# EAGLE design untitled (EAGLE 9.6.2)
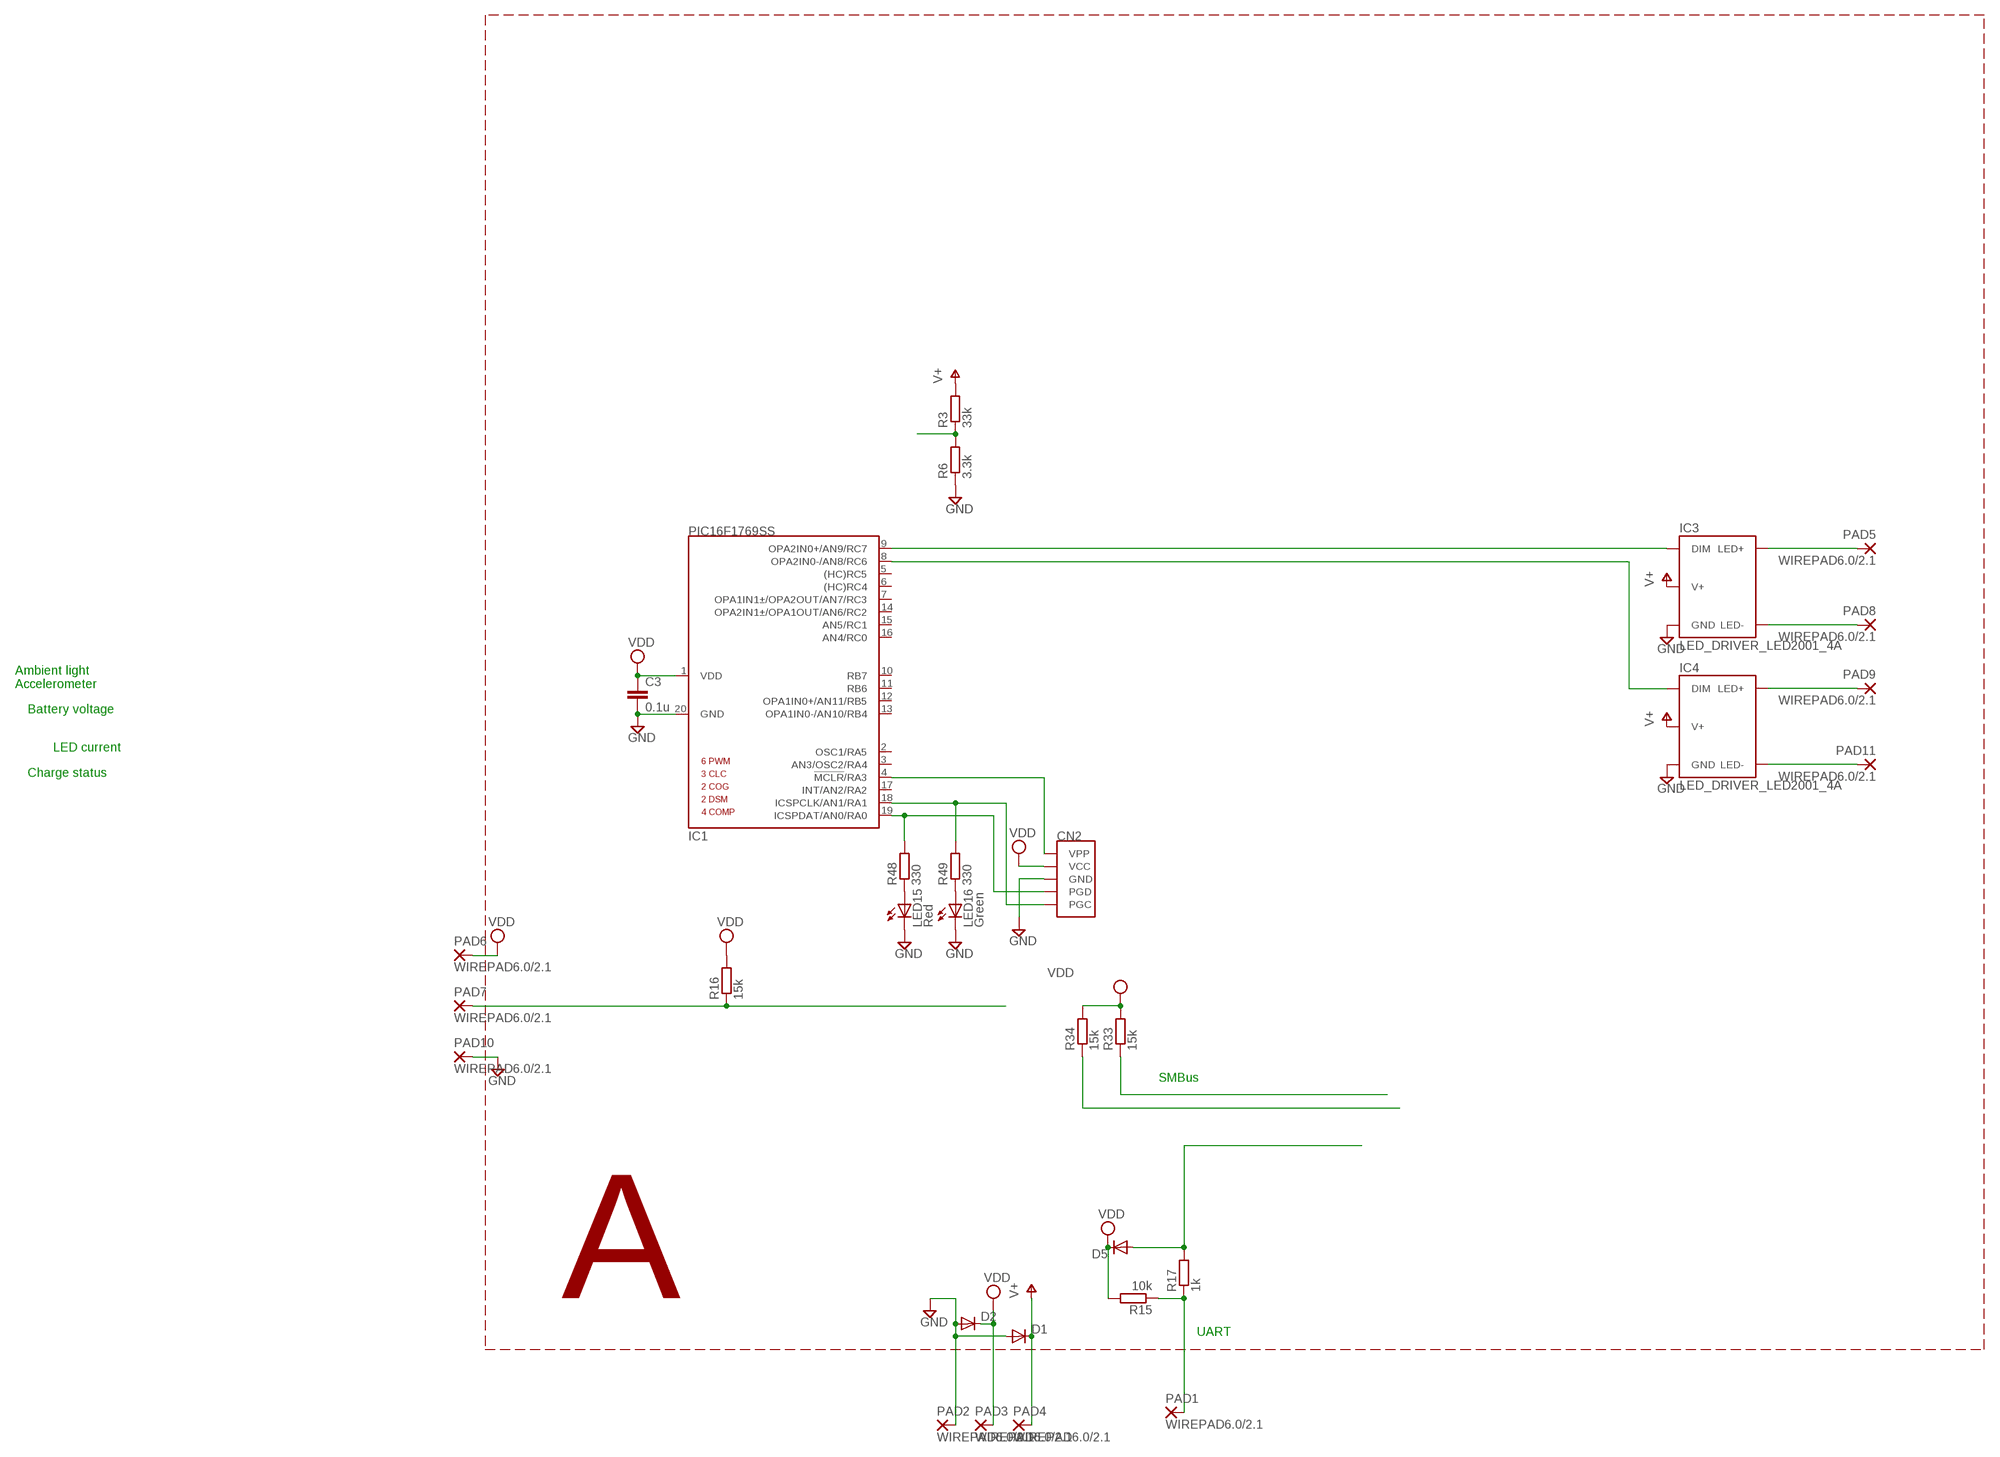
[diagram p0: schematic, sheet 1]

## Parts
C3  0.1u  C-EUC0402  [C0402]
CN2  ICSPPIN  [MINI-ICSP_PIN]
D1  DIODE-VMN2  [VMN2]
D2  DIODE-VMN2  [VMN2]
D5  DIODE-VMN2  [VMN2]
IC1  PIC16F1769SS  [SSOP20]
IC3  LED_DRIVER_LED2001_4A  [LED_DRIVER_LED2001_4A]
IC4  LED_DRIVER_LED2001_4A  [LED_DRIVER_LED2001_4A]
LED15  Red  LED3MM  [LED3MM]
LED16  Green  LED3MM  [LED3MM]
PAD1  WIREPAD6.0/2.1  [6.0/2.1]
PAD2  WIREPAD6.0/2.1  [6.0/2.1]
PAD3  WIREPAD6.0/2.1  [6.0/2.1]
PAD4  WIREPAD6.0/2.1  [6.0/2.1]
PAD5  WIREPAD6.0/2.1  [6.0/2.1]
PAD6  WIREPAD6.0/2.1  [6.0/2.1]
PAD7  WIREPAD6.0/2.1  [6.0/2.1]
PAD8  WIREPAD6.0/2.1  [6.0/2.1]
PAD9  WIREPAD6.0/2.1  [6.0/2.1]
PAD10  WIREPAD6.0/2.1  [6.0/2.1]
PAD11  WIREPAD6.0/2.1  [6.0/2.1]
R3  33k  R-EU_R0402  [R0402]
R6  3.3k  R-EU_R0402  [R0402]
R15  10k  R-EU_R0402  [R0402]
R16  15k  R-EU_R0402  [R0402]
R17  1k  R-EU_R0402  [R0402]
R33  15k  R-EU_R0402  [R0402]
R34  15k  R-EU_R0402  [R0402]
R48  330  R-EU_R0402  [R0402]
R49  330  R-EU_R0402  [R0402]

## Nets
GND: C3.2 CN2.GND D1.A D2.A IC1.20(GND) IC3.GND IC4.GND LED15.K(C) LED16.K(C) PAD2.1(P) PAD10.1(P) R6.1
N$1: IC3.LED+ PAD5.1(P)
N$2: IC3.LED- PAD8.1(P)
N$3: CN2.VPP IC1.4(!MCLR!/RA3)
N$4: R3.1 R6.2
N$5: IC4.LED+ PAD9.1(P)
N$6: IC4.LED- PAD11.1(P)
N$7: IC1.9(OPA2IN0+/AN9/RC7) IC3.DIM
N$8: IC1.8(OPA2IN0-/AN8/RC6) IC4.DIM
N$14: CN2.PGD IC1.19(ICSPDAT/AN0/RA0) R48.2
N$16: CN2.PGC IC1.18(ICSPCLK/AN1/RA1) R49.2
N$23: PAD7.1(P) R16.1
N$31: D5.A R17.2
N$57: PAD1.1(P) R15.1 R17.1
N$70: R34.1
N$71: R33.1
N$103: LED15.A R48.1
N$104: LED16.A R49.1
V+: D1.C IC3.V+ IC4.V+ PAD4.1(P) R3.2
VDD: C3.1 CN2.VCC D2.C D5.C IC1.1(VDD) PAD3.1(P) PAD6.1(P) R15.2 R16.2 R33.2 R34.2
Unconnected: IC1.2(OSC1/RA5) IC1.3(AN3/OSC2/RA4) IC1.5((HC)RC5) IC1.6((HC)RC4) IC1.7(OPA1IN1±/OPA2OUT/AN7/RC3) IC1.10(RB7) IC1.11(RB6) IC1.12(OPA1IN0+/AN11/RB5) IC1.13(OPA1IN0-/AN10/RB4) IC1.14(OPA2IN1±/OPA1OUT/AN6/RC2) IC1.15(AN5/RC1) IC1.16(AN4/RC0) IC1.17(INT/AN2/RA2)

## Notes on the sheet
- Ambient light
  Accelerometer
- Battery voltage
- LED current
- Charge status
- SMBus
- A
- UART

## Library data of the parts
C3 = rcl:C-EU: CAPACITOR, European symbol; SPICEPREFIX: C
CN2 = 0 my parts:ICSP
D1 D2 D5 = 5 D:DIODE-: DIODE
IC1 = 0 my parts:PIC16F1769
IC3 IC4 = 0 my parts:LED_DRIVER_LED2001_4A
LED15 LED16 = 0 my parts:LED: LED OSRAM: - CHIPLED LG R971, LG N971, LY N971, LG Q971, LY Q971, LO R971, LY R971 LH N974, LH R974 LS Q976, LO Q976, LY Q976 LO Q996 - Hyper CHIPLED LW Q18S LB Q993, LB Q99A, LB R99A - SideLED LS A670, LO A670, LY A670, LG A670, LP A670 LB A673, LV A673, LT A673, LW A673 LH A674 LY A675 LS A676, LA A676, LO A676, LY A676, LW A676 LS A679, LY A679, LG A679 - Hyper Micro SIDELED® LS Y876, LA Y876, LO Y876, LY Y876 LT Y87S - SmartLED LW L88C, LW L88S LB L89C, LB L89S, LG L890 LS L89K, LO L89K, LY L89K LS L896, LA L896, LO L896, LY L896 - TOPLED LS T670, LO T670, LY T670, LG T670, LP T670 LSG T670, LSP T670, LSY T670, LOP T670, LYG T670 LG T671, LOG T671, LSG T671 LB T673, LV T673, LT T673, LW T673 LH T674 LS T676, LA T676, LO T676, LY T676, LB T676, LH T676, LSB T676, LW T676 LB T67C, LV T67C, LT T67C, LS T67K, LO T67K, LY T67K, LW E67C LS E67B, LA E67B, LO E67B, LY E67B, LB E67C, LV E67C, LT E67C LW T67C LS T679, LY T679, LG T679 LS T770, LO T770, LY T770, LG T770, LP T770 LB T773, LV T773, LT T773, LW T773 LH T774 LS E675, LA E675, LY E675, LS T675 LS T776, LA T776, LO T776, LY T776, LB T776 LHGB T686 LT T68C, LB T68C - Hyper Mini TOPLED® LB M676 - Mini TOPLED Santana® LG M470 LS M47K, LO M47K, LY M47K Source: http://www.osram.convergy.de - LUMILED® LXK2-PW12-R00, LXK2-PW12-S00, LXK2-PW14-U00, LXK2-PW14-V00 LXK2-PM12-R00, LXK2-PM12-S00, LXK2-PM14-U00 LXK2-PE12-Q00, LXK2-PE12-R00, LXK2-PE12-S00, LXK2-PE14-T00, LXK2-PE14-U00 LXK2-PB12-K00, LXK2-PB12-L00, LXK2-PB12-M00, LXK2-PB14-N00, LXK2-PB14-P00, LXK2-PB14-Q00 LXK2-PR12-L00, LXK2-PR12-M00, LXK2-PR14-Q00, LXK2-PR14-R00 LXK2-PD12-Q00, LXK2-PD12-R00, LXK2-PD12-S00 LXK2-PH12-R00, LXK2-PH12-S00 LXK2-PL12-P00, LXK2-PL12-Q00, LXK2-PL12-R00 Source: www.luxeon.com
PAD1-PAD11 = 4 PAD:WIREPAD: Wire PAD connect wire on PCB
R3 R6 R15-R17 R33 R34 R48 R49 = rcl:R-EU_: RESISTOR, European symbol; SPICEPREFIX: R

## Board
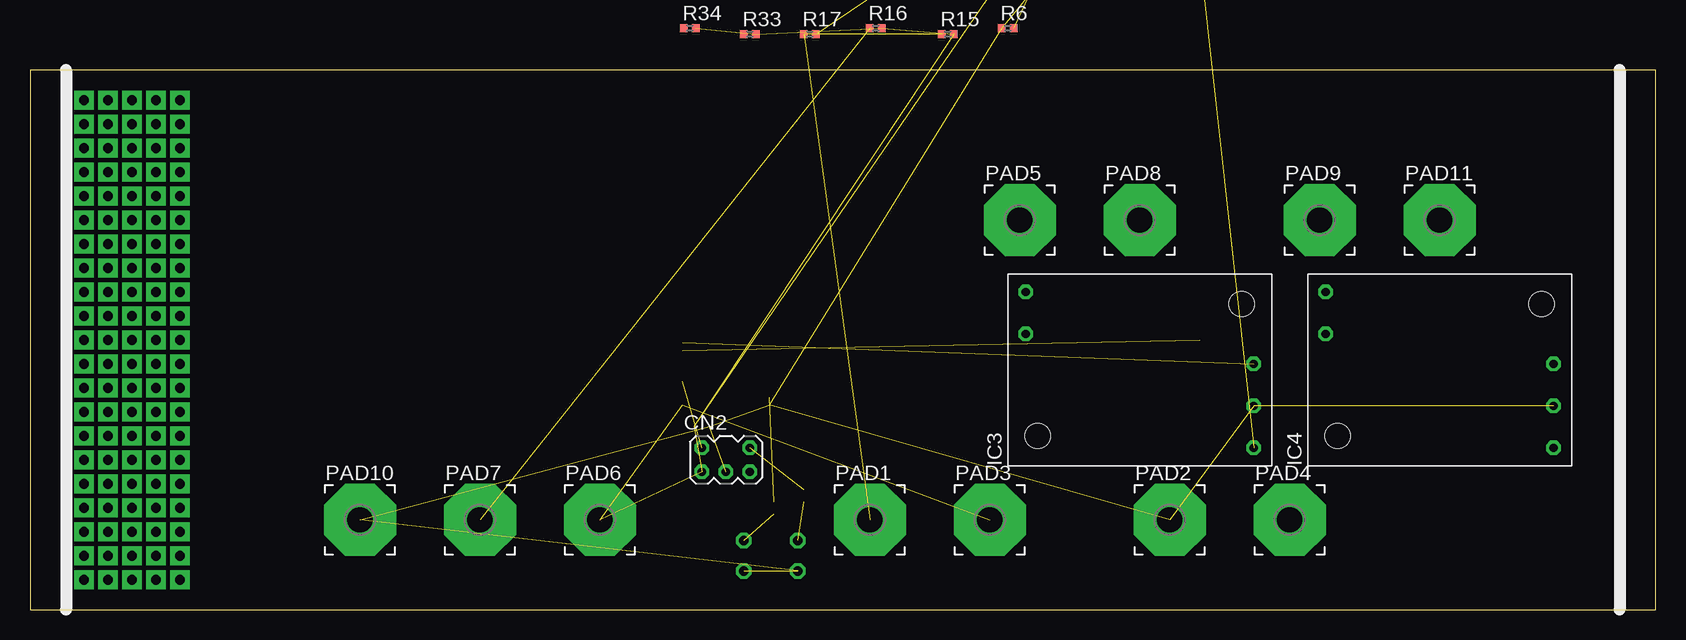
[diagram p1: board, top side]
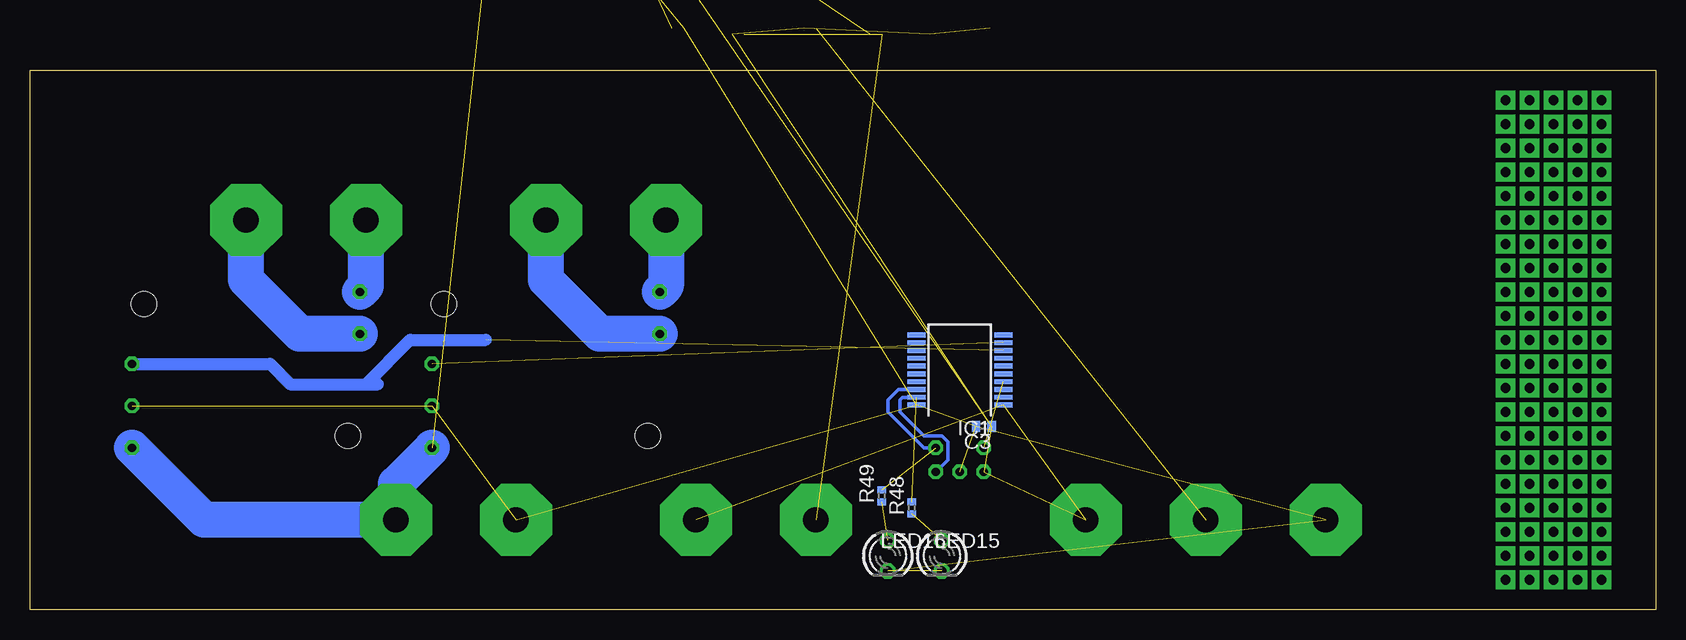
[diagram p2: board, bottom side, seen from below]

Size 135.5 x 45 mm. Coordinates in mm from the lower left corner, seen from the top.
Outline: 0,0 135.5,0 135.5,45 0,45 0,0
Copper layers (1*16): Top 0.035mm / dielectric 1.5mm / Bottom 0.035mm
Design rules "default": minimum track width 6mil, minimum drill 0.35mm, track to track 6mil, track to pad 6mil, pad to pad 6mil, via to via 6mil, smd to smd 6mil, copper to edge 40mil, drill to drill 6mil, minimum pad ring 10mil, minimum via ring 8mil, stop-mask expansion 4mil, vias tented up to drill 0mil, thermal gap 10mil

### Footprints (pad centres in the part's own frame; a part is rotated, then mirrored left to right if it is on the bottom)
C0402 = smd 0.7 x 0.9: 1 -0.65,0; 2 0.65,0
MINI-ICSP_PIN = drill 0.7 octagon: GND 0,-1; PGC 2,1; PGD 2,-1; VCC -2,-1; VPP -2,1
VMN2 = smd 0.65 x 0.55: A 0.6,0; C -0.6,0
SSOP20 = smd 0.4 x 1.5: 1 -2.925,-3.625; 2 -2.275,-3.625; 3 -1.625,-3.625; 4 -0.975,-3.625; 5 -0.325,-3.625; 6 0.325,-3.625; 7 0.975,-3.625; 8 1.625,-3.625; 9 2.275,-3.625; 10 2.925,-3.625; 11 2.925,3.625; 12 2.275,3.625; 13 1.625,3.625; 14 0.975,3.625; 15 0.325,3.625; 16 -0.325,3.625; 17 -0.975,3.625; 18 -1.625,3.625; 19 -2.275,3.625; 20 -2.925,3.625
LED_DRIVER_LED2001_4A = drill 0.7 octagon: DIM 0.5,-9.5; GND -3,-9.5; LED+ 6.5,9.5; LED- 3,9.5; V+ -6.5,-9.5 | hole 2.1: -5.5,8.5; 5.5,-8.5
LED3MM = drill 0.813 octagon: A -1.27,0; K 1.27,0
6.0/2.1 = drill 2.1 pad 6 octagon: 1 0,0
R0402 = smd 0.6 x 0.7: 1 -0.5,0; 2 0.5,0

### Placement (x,y rotation side)
C3  56,15.3 180 bottom
CN2  58,12.5 0 top
D1  97,64.5 0 top  (outside the outline)
D2  93.5,64.5 0 top  (outside the outline)
D5  90,65 0 top  (outside the outline)
IC1  58,20 90 bottom
IC3  92.5,20 90 top
IC4  117.5,20 90 top
LED15  59.5,4.5 270 bottom
LED16  64,4.5 270 bottom
PAD1  70,7.5 0 top
PAD2  95,7.5 0 top
PAD3  80,7.5 0 top
PAD4  105,7.5 0 top
PAD5  82.5,32.5 0 top
PAD6  47.5,7.5 0 top
PAD7  37.5,7.5 0 top
PAD8  92.5,32.5 0 top
PAD9  107.5,32.5 0 top
PAD10  27.5,7.5 0 top
PAD11  117.5,32.5 0 top
R3  86,56 0 top  (outside the outline)
R6  81.5,48.5 0 top  (outside the outline)
R15  76.5,48 0 top
R16  70.5,48.5 0 top  (outside the outline)
R17  65,48 0 top
R33  60,48 0 top
R34  55,48.5 0 top  (outside the outline)
R48  62,8.5 90 bottom
R49  64.5,9.5 90 bottom
U$1  [RULER]  0,-7.5 0 top  (outside the outline)
U$2  [RULER-S]  -5,0 90 top  (outside the outline)

### Tracks (layer width: path | path; a pad name or v marks a point on that pad's centre or on a via)
GND  (11 unrouted)
N$1
  Bottom 3: PAD5.1 82.5,27 IC3.LED+
N$2
  Bottom 3: IC3.LED- 88,23 92.5,27.5 PAD8.1
N$3  (1 unrouted)
N$4  (1 unrouted)
N$5
  Bottom 3: IC4.LED+ 107.5,27 PAD9.1
N$6
  Bottom 3: IC4.LED- 113,23 117.5,27.5 PAD11.1
N$7  (1 unrouted)
N$8  (1 unrouted)
  Bottom 1: IC4.DIM 115.5,20.5 113.8,18.8 107.5,18.8 | 107.5,18.8 106.5,18.8 | 107.5,18.8 103.8,22.5 97.5,22.5
N$9  (via drill 0.8 pad 1.6)
  other vias: 4.5,38.5
N$10  (via drill 0.8 pad 1.6)
  other vias: 4.5,36.5
N$11  (via drill 0.8 pad 1.6)
  other vias: 4.5,34.5
N$12  (via drill 0.8 pad 1.6)
  other vias: 4.5,32.5
N$13  (via drill 0.8 pad 1.6)
  other vias: 4.5,30.5
N$14  (1 unrouted)
  Bottom 0.3: IC1.19 62.77,17.73 63,17.5 63,16.5 61,14.5 59.5,14.5 59,14 59,12.5 CN2.PGD
N$15  (via drill 0.8 pad 1.6)
  other vias: 4.5,28.5
N$16  (1 unrouted)
  Bottom 0.3: IC1.18 63.12,18.38 64,17.5 64,16.5 61,13.5 CN2.PGC
N$17  (via drill 0.8 pad 1.6)
  other vias: 4.5,26.5
N$18  (via drill 0.8 pad 1.6)
  other vias: 4.5,24.5
N$19  (via drill 0.8 pad 1.6)
  other vias: 4.5,22.5
N$20  (via drill 0.8 pad 1.6)
  other vias: 4.5,20.5
N$21  (via drill 0.8 pad 1.6)
  other vias: 4.5,18.5
N$22  (via drill 0.8 pad 1.6)
  other vias: 4.5,16.5
N$23  (1 unrouted)
N$24  (via drill 0.8 pad 1.6)
  other vias: 4.5,14.5
N$25  (via drill 0.8 pad 1.6)
  other vias: 4.5,12.5
N$26  (via drill 0.8 pad 1.6)
  other vias: 4.5,10.5
N$27  (via drill 0.8 pad 1.6)
  other vias: 4.5,8.5
N$28  (via drill 0.8 pad 1.6)
  other vias: 4.5,6.5
N$29  (via drill 0.8 pad 1.6)
  other vias: 4.5,4.5
N$30  (via drill 0.8 pad 1.6)
  other vias: 4.5,2.5
N$31  (1 unrouted)
N$32  (via drill 0.8 pad 1.6)
  other vias: 6.5,38.5
N$33  (via drill 0.8 pad 1.6)
  other vias: 6.5,36.5
N$34  (via drill 0.8 pad 1.6)
  other vias: 6.5,34.5
N$35  (via drill 0.8 pad 1.6)
  other vias: 6.5,32.5
N$36  (via drill 0.8 pad 1.6)
  other vias: 6.5,30.5
N$37  (via drill 0.8 pad 1.6)
  other vias: 6.5,28.5
N$38  (via drill 0.8 pad 1.6)
  other vias: 6.5,26.5
N$39  (via drill 0.8 pad 1.6)
  other vias: 6.5,24.5
N$40  (via drill 0.8 pad 1.6)
  other vias: 6.5,22.5
N$41  (via drill 0.8 pad 1.6)
  other vias: 6.5,20.5
N$42  (via drill 0.8 pad 1.6)
  other vias: 6.5,18.5
N$43  (via drill 0.8 pad 1.6)
  other vias: 6.5,16.5
N$44  (via drill 0.8 pad 1.6)
  other vias: 6.5,14.5
N$45  (via drill 0.8 pad 1.6)
  other vias: 6.5,12.5
N$46  (via drill 0.8 pad 1.6)
  other vias: 6.5,10.5
N$47  (via drill 0.8 pad 1.6)
  other vias: 6.5,8.5
N$48  (via drill 0.8 pad 1.6)
  other vias: 6.5,6.5
N$49  (via drill 0.8 pad 1.6)
  other vias: 6.5,4.5
N$50  (via drill 0.8 pad 1.6)
  other vias: 6.5,2.5
N$51  (via drill 0.8 pad 1.6)
  other vias: 8.5,38.5
N$52  (via drill 0.8 pad 1.6)
  other vias: 8.5,36.5
N$53  (via drill 0.8 pad 1.6)
  other vias: 8.5,34.5
N$54  (via drill 0.8 pad 1.6)
  other vias: 8.5,32.5
N$55  (via drill 0.8 pad 1.6)
  other vias: 8.5,30.5
N$56  (via drill 0.8 pad 1.6)
  other vias: 8.5,28.5
N$57  (2 unrouted)
N$58  (via drill 0.8 pad 1.6)
  other vias: 8.5,26.5
N$59  (via drill 0.8 pad 1.6)
  other vias: 8.5,24.5
N$60  (via drill 0.8 pad 1.6)
  other vias: 8.5,22.5
N$61  (via drill 0.8 pad 1.6)
  other vias: 8.5,20.5
N$62  (via drill 0.8 pad 1.6)
  other vias: 8.5,18.5
N$63  (via drill 0.8 pad 1.6)
  other vias: 8.5,16.5
N$64  (via drill 0.8 pad 1.6)
  other vias: 8.5,14.5
N$65  (via drill 0.8 pad 1.6)
  other vias: 8.5,12.5
N$66  (via drill 0.8 pad 1.6)
  other vias: 8.5,10.5
N$67  (via drill 0.8 pad 1.6)
  other vias: 8.5,8.5
N$68  (via drill 0.8 pad 1.6)
  other vias: 8.5,6.5
N$69  (via drill 0.8 pad 1.6)
  other vias: 8.5,4.5
N$72  (via drill 0.8 pad 1.6)
  other vias: 8.5,2.5
N$73  (via drill 0.8 pad 1.6)
  other vias: 10.5,38.5
N$74  (via drill 0.8 pad 1.6)
  other vias: 10.5,36.5
N$75  (via drill 0.8 pad 1.6)
  other vias: 10.5,34.5
N$76  (via drill 0.8 pad 1.6)
  other vias: 10.5,32.5
N$77  (via drill 0.8 pad 1.6)
  other vias: 10.5,30.5
N$78  (via drill 0.8 pad 1.6)
  other vias: 10.5,28.5
N$79  (via drill 0.8 pad 1.6)
  other vias: 10.5,26.5
N$80  (via drill 0.8 pad 1.6)
  other vias: 10.5,24.5
N$81  (via drill 0.8 pad 1.6)
  other vias: 10.5,22.5
N$82  (via drill 0.8 pad 1.6)
  other vias: 10.5,20.5
N$83  (via drill 0.8 pad 1.6)
  other vias: 10.5,18.5
N$84  (via drill 0.8 pad 1.6)
  other vias: 10.5,16.5
N$85  (via drill 0.8 pad 1.6)
  other vias: 10.5,14.5
N$86  (via drill 0.8 pad 1.6)
  other vias: 10.5,12.5
N$87  (via drill 0.8 pad 1.6)
  other vias: 10.5,10.5
N$88  (via drill 0.8 pad 1.6)
  other vias: 10.5,8.5
N$89  (via drill 0.8 pad 1.6)
  other vias: 10.5,6.5
N$90  (via drill 0.8 pad 1.6)
  other vias: 10.5,4.5
N$91  (via drill 0.8 pad 1.6)
  other vias: 10.5,2.5
N$92  (via drill 0.8 pad 1.6)
  other vias: 12.5,38.5
N$93  (via drill 0.8 pad 1.6)
  other vias: 12.5,36.5
N$94  (via drill 0.8 pad 1.6)
  other vias: 12.5,34.5
N$95  (via drill 0.8 pad 1.6)
  other vias: 12.5,32.5
N$96  (via drill 0.8 pad 1.6)
  other vias: 12.5,30.5
N$97  (via drill 0.8 pad 1.6)
  other vias: 12.5,28.5
N$98  (via drill 0.8 pad 1.6)
  other vias: 12.5,26.5
N$99  (via drill 0.8 pad 1.6)
  other vias: 12.5,24.5
N$100  (via drill 0.8 pad 1.6)
  other vias: 12.5,22.5
N$101  (via drill 0.8 pad 1.6)
  other vias: 12.5,20.5
N$102  (via drill 0.8 pad 1.6)
  other vias: 12.5,18.5
N$103  (1 unrouted)
N$104  (1 unrouted)
N$105  (via drill 0.8 pad 1.6)
  other vias: 12.5,16.5
N$106  (via drill 0.8 pad 1.6)
  other vias: 12.5,14.5
N$107  (via drill 0.8 pad 1.6)
  other vias: 12.5,12.5
N$108  (via drill 0.8 pad 1.6)
  other vias: 12.5,10.5
N$109  (via drill 0.8 pad 1.6)
  other vias: 12.5,8.5
N$110  (via drill 0.8 pad 1.6)
  other vias: 12.5,6.5
N$111  (via drill 0.8 pad 1.6)
  other vias: 12.5,4.5
N$112  (via drill 0.8 pad 1.6)
  other vias: 12.5,2.5
N$129  (via drill 0.8 pad 1.6)
  other vias: 4.5,42.5
N$130  (via drill 0.8 pad 1.6)
  other vias: 4.5,40.5
N$131  (via drill 0.8 pad 1.6)
  other vias: 6.5,42.5
N$132  (via drill 0.8 pad 1.6)
  other vias: 6.5,40.5
N$133  (via drill 0.8 pad 1.6)
  other vias: 8.5,42.5
N$134  (via drill 0.8 pad 1.6)
  other vias: 8.5,40.5
N$135  (via drill 0.8 pad 1.6)
  other vias: 10.5,42.5
N$136  (via drill 0.8 pad 1.6)
  other vias: 10.5,40.5
N$137  (via drill 0.8 pad 1.6)
  other vias: 12.5,42.5
N$138  (via drill 0.8 pad 1.6)
  other vias: 12.5,40.5
V+  (2 unrouted)
  Bottom 3: IC3.V+ 105,10.5 PAD4.1 121,7.5 IC4.V+
VDD  (10 unrouted)